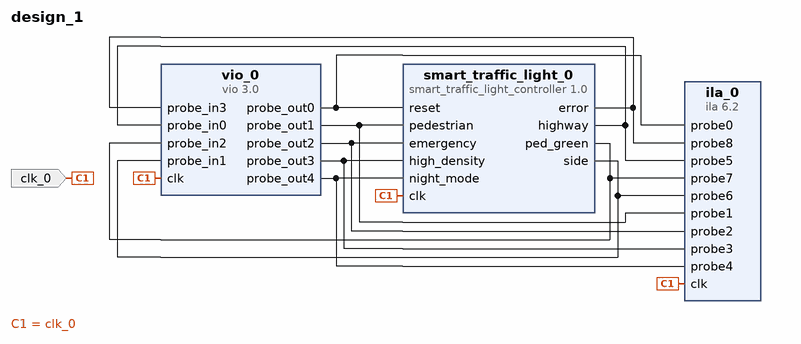
[diagram p0: block diagram of the top level]
# Vivado block design design_1, xc7z020clg400-1, Vivado 2024.1
create_bd_design design_1

create_bd_port -dir I -type clk clk_0

create_bd_cell -type ip -vlnv xilinx.com:user:smart_traffic_light_controller:1.0 smart_traffic_light_0
create_bd_cell -type ip -vlnv xilinx.com:ip:vio:3.0 vio_0
set_property -dict {CONFIG.C_NUM_PROBE_IN 4 CONFIG.C_NUM_PROBE_OUT 5} [get_bd_cells vio_0]
create_bd_cell -type ip -vlnv xilinx.com:ip:ila:6.2 ila_0
set_property -dict [list \
  CONFIG.C_MONITOR_TYPE Native \
  CONFIG.C_NUM_OF_PROBES 9 \
  CONFIG.C_PROBE4_WIDTH 1 \
  CONFIG.C_PROBE5_WIDTH 3 \
  CONFIG.C_PROBE6_WIDTH 3 \
] [get_bd_cells ila_0]

# ---- connections ----

connect_bd_net -net clk_0_1 [get_bd_ports clk_0] [get_bd_pins ila_0/clk] [get_bd_pins vio_0/clk] [get_bd_pins smart_traffic_light_0/clk]
connect_bd_net [get_bd_pins smart_traffic_light_0/error] [get_bd_pins vio_0/probe_in3] [get_bd_pins ila_0/probe8]
connect_bd_net [get_bd_pins smart_traffic_light_0/highway] [get_bd_pins vio_0/probe_in0] [get_bd_pins ila_0/probe5]
connect_bd_net [get_bd_pins smart_traffic_light_0/ped_green] [get_bd_pins vio_0/probe_in2] [get_bd_pins ila_0/probe7]
connect_bd_net [get_bd_pins smart_traffic_light_0/side] [get_bd_pins vio_0/probe_in1] [get_bd_pins ila_0/probe6]
connect_bd_net [get_bd_pins vio_0/probe_out0] [get_bd_pins smart_traffic_light_0/reset] [get_bd_pins ila_0/probe0]
connect_bd_net [get_bd_pins vio_0/probe_out1] [get_bd_pins smart_traffic_light_0/pedestrian] [get_bd_pins ila_0/probe1]
connect_bd_net [get_bd_pins vio_0/probe_out2] [get_bd_pins smart_traffic_light_0/emergency] [get_bd_pins ila_0/probe2]
connect_bd_net [get_bd_pins vio_0/probe_out3] [get_bd_pins smart_traffic_light_0/high_density] [get_bd_pins ila_0/probe3]
connect_bd_net [get_bd_pins vio_0/probe_out4] [get_bd_pins smart_traffic_light_0/night_mode] [get_bd_pins ila_0/probe4]

validate_bd_design
save_bd_design
